# EAGLE design Addon-mapleCUx_HM-RFM69-RFM95-V15-003-TX-Fix (EAGLE 9.3.0)
MAPLE-CUx Large Version
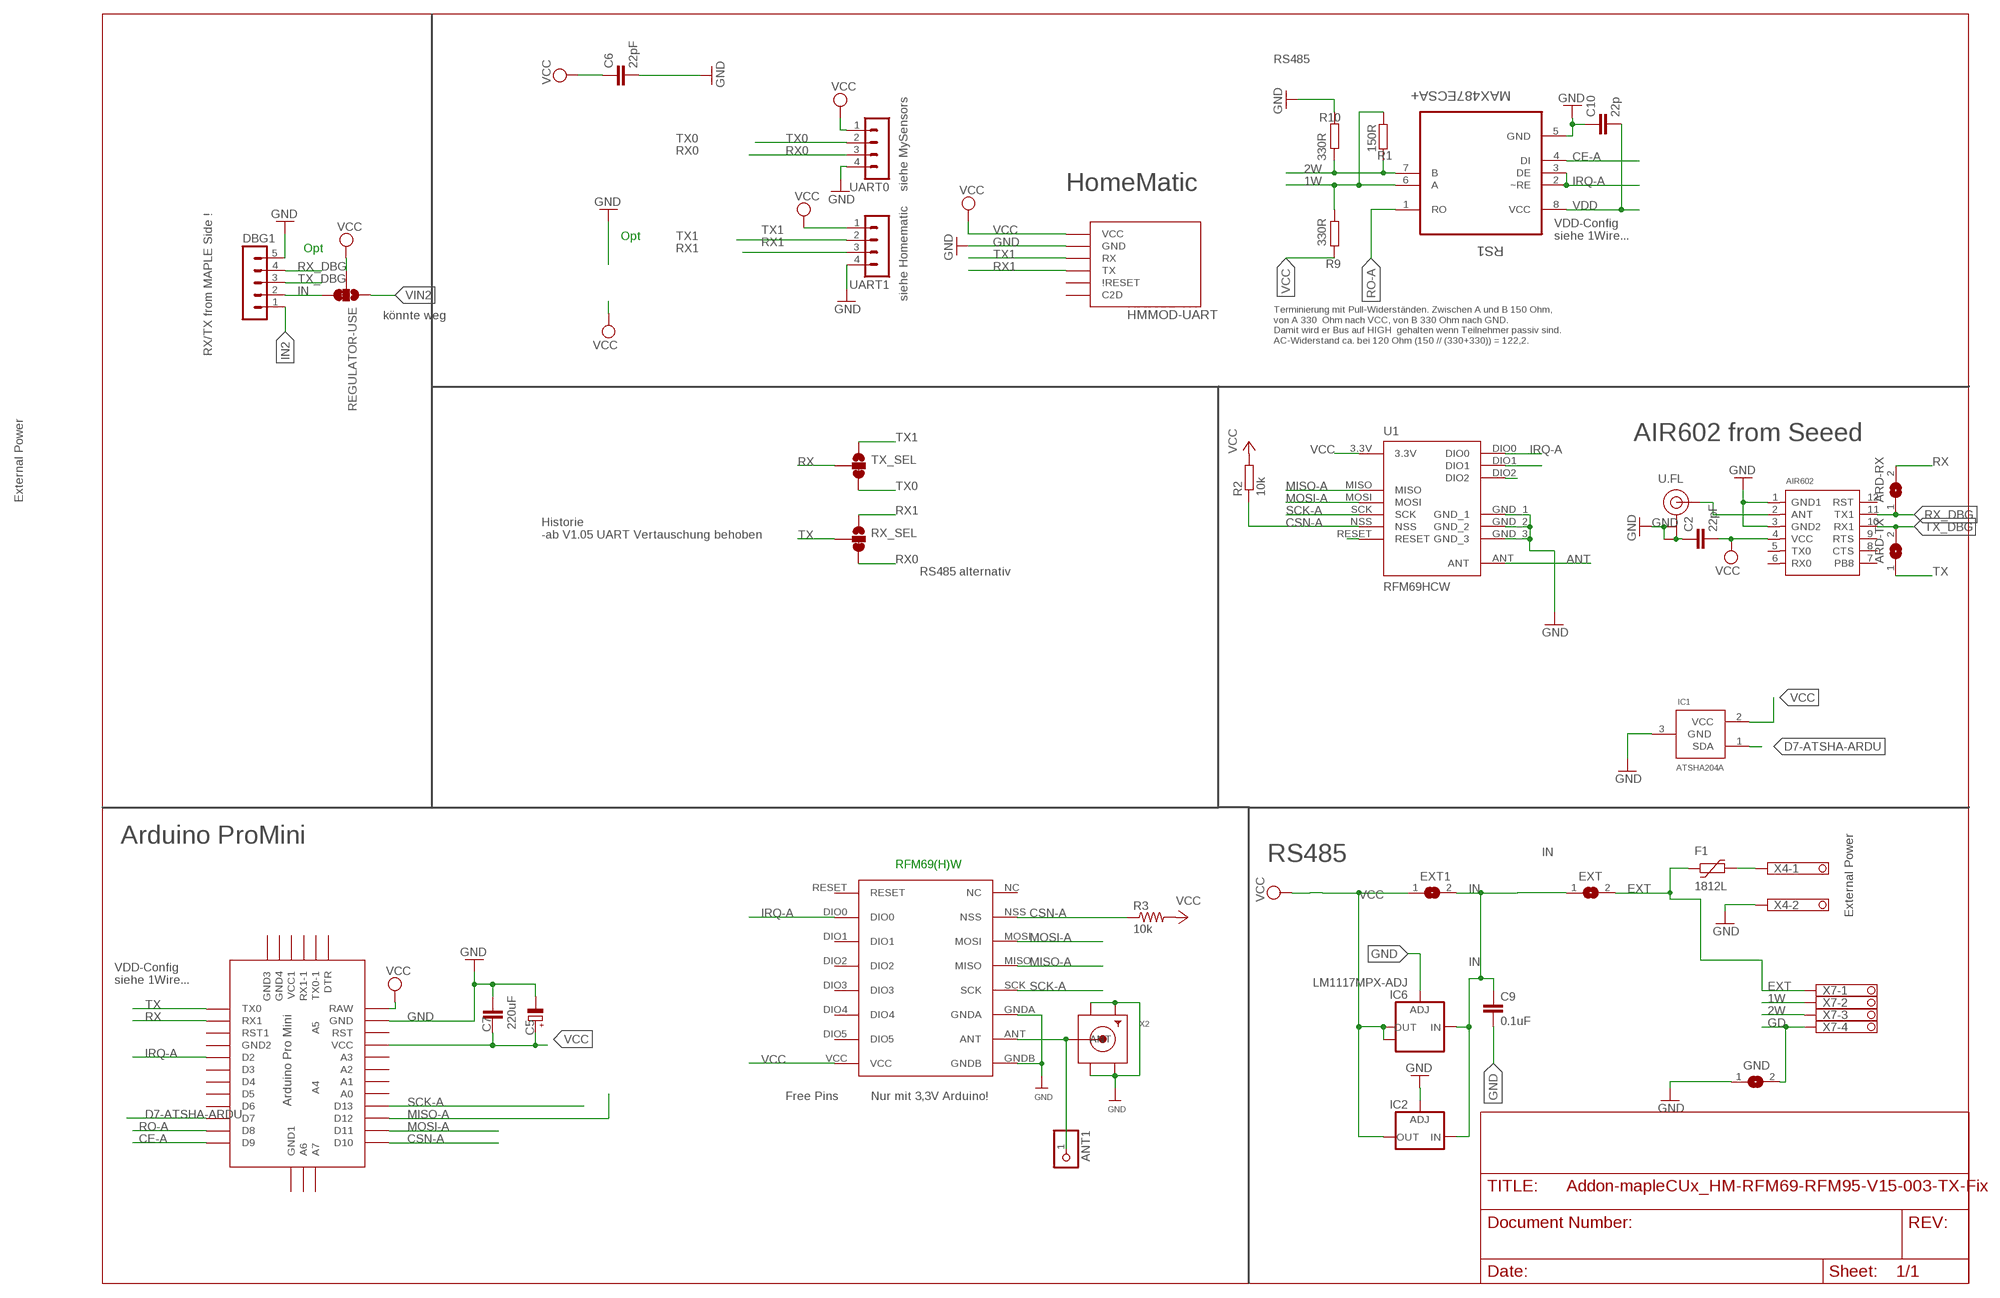
[diagram p0: schematic, sheet 1]

## Parts
AIR602  AIR602  [MODULE12P-2.0-10X12MM]
ANT1  PINHD-1X1  [1X01]
ARD-RX  SJ  [SJ]
ARD-TX  SJ  [SJ]
C2  22pF  C-EUC0805  [C0805]
C5  220uF  CPOL-EUE5-8.5  [E5-8,5]
C6  22pF  C-EUC0805  [C0805]
C7  C-EUC1812  [C1812]
C9  0.1uF  C-EUC1206  [C1206]
C10  22p  C-EUC0805  [C0805]
DBG1  MA05-1  [MA05-1]
EXT  SJ  [SJ]
EXT1  SJ  [SJ]
F1  1812L  [1812L]
GND  SJ  [SJ]
HMMOD-UART  HM-MOD-UARTDIL  [HM-MOD-UART-DIL]
IC1  ATSHA204A  [SOT23]
IC2  LD117ADT50TR  [DPACK]
IC6  LM1117MPX-ADJ  [SOT223]
R1  150R  R-EU_R0805  [R0805]
R2  10k  R-EU_M0805  [M0805]
R3  10k  RESISTOR0805-RES  [0805]
R9  330R  R-EU_R0805  [R0805]
R10  330R  R-EU_R0805  [R0805]
REGULATOR-USE  JUMPER-SMT_3_1-NC_TRACE_SILK  [SMT-JUMPER_3_1-NC_TRACE_SILK]
RFM69W  RFM69HW  [RFM]
RS1  MAX487ECSA+  [SOIC127P600X175-8N]
RX_SEL  JUMPER-SMT_3_1-NC_TRACE_SILK  [SMT-JUMPER_3_1-NC_TRACE_SILK]
TX_SEL  JUMPER-SMT_3_1-NC_TRACE_SILK  [SMT-JUMPER_3_1-NC_TRACE_SILK]
U1  RFM69HCW  [RFM69HCW-XXXS2]
U$2  ABK-PRO-MINI  [ABK-PRO-MINI]
U.FL  U.FL  [U.FL]
UART0  MA04-1  [MA04-1]
UART1  MA04-1  [MA04-1]
X2  SMACONNECTOR_EDGE  [SMA_EDGELAUNCH]
X4  1751248  [1751248]
X7  1751264  [1751264]

## Nets
1W: R1.1 R9.2 RS1.6(A) X7.2
2W: R1.2 R10.1 RS1.7(B) X7.3
AN: AIR602.2(ANT) U.FL.FEED(SIGNAL)
ANT: ANT1.1 RFM69W.ANT U1.ANT X2.P(ANT)
CE-A: RS1.4(DI) U$2.D9
CSN-A: R2.1 R3.1 RFM69W.NSS U1.NSS U$2.D10
D7-ATSHA-ARDU: IC1.1(SDA) U$2.D7
EXT [PWR]: EXT.2 F1.P$1 X7.1
GD [PWR]: GND.2 X7.4
GND [PWR]: AIR602.1(GND1) AIR602.3(GND2) C2.1 C5.- C6.2 C7.1 C9.2 C10.1 DBG1.5 GND.1 HMMOD-UART.2(GND) IC1.3(GND) IC2.1(ADJ) IC6.1(ADJ) R10.2 RFM69W.GNDA RFM69W.GNDB RS1.5(GND) U1.GND_1 U1.GND_2 U1.GND_3 U$2.GND U.FL.1(GND) U.FL.2(GND) UART0.4 UART1.4 X2.GND@1(GND4) X2.GND@2(GND3) X2.GND@3(GND2) X2.GND@4(GND1) X4.2
IN [PWR]: C9.1 DBG1.2 EXT1.2 EXT.1 IC2.3(IN) IC6.3(IN) REGULATOR-USE.3
IN2 [PWR]: DBG1.1
IRQ-A: RFM69W.DIO0 RS1.2(~RE) RS1.3(DE) U1.DIO0 U$2.D2
MISO-A: RFM69W.MISO U1.MISO U$2.D12
MOSI-A: RFM69W.MOSI U1.MOSI U$2.D11
N$2: U1.RESET
N$14: U1.DIO2
N$15: U1.DIO1
N$45 [PWR]: F1.P$2 X4.1
RO-A: RS1.1(RO) U$2.D8
RX: ARD-RX.2 TX_SEL.2 U$2.RX1
RX0: RX_SEL.3 UART0.3
RX1: HMMOD-UART.5(TX) RX_SEL.1 UART1.3
RX_DBG: AIR602.11(TX1) ARD-RX.1 DBG1.4
SCK-A: RFM69W.SCK U1.SCK U$2.D13
TX: ARD-TX.1 RX_SEL.2 U$2.TX0
TX0: TX_SEL.3 UART0.2
TX1: HMMOD-UART.6(RX) TX_SEL.1 UART1.2
TX_DBG: AIR602.10(RX1) ARD-TX.2 DBG1.3
VCC [PWR]: AIR602.4(VCC) C2.2 C5.+ C6.1 C7.2 EXT1.1 HMMOD-UART.1(VCC) IC1.2(VCC) IC2.4(OUT) IC6.2(OUT) IC6.TAB(OUT1) R2.2 R3.2 R9.1 REGULATOR-USE.2 RFM69W.VCC U1.3.3V U$2.RAW U$2.VCC UART0.1 UART1.1
VDD [PWR]: C10.2 RS1.8(VCC)
VIN2 [PWR]: REGULATOR-USE.1
Unconnected: AIR602.5(TX0) AIR602.6(RX0) AIR602.7(PB8) AIR602.8(CTS) AIR602.9(RTS) AIR602.12(RST) HMMOD-UART.3(C2D) HMMOD-UART.4(\!RESET) RFM69W.DIO1 RFM69W.DIO2 RFM69W.DIO3 RFM69W.DIO4 RFM69W.DIO5 RFM69W.NC RFM69W.RESET U$2.A0 U$2.A1 U$2.A2 U$2.A3 U$2.A4 U$2.A5 U$2.A6 U$2.A7 U$2.D3 U$2.D4 U$2.D5 U$2.D6 U$2.DTR U$2.GND1(GND2) U$2.GND2(GND3) U$2.GND3(GND4) U$2.GND4(GND1) U$2.RST U$2.RST1 U$2.RX1-1 U$2.TX0-1 U$2.VCC1

## Notes on the sheet
- RS485
- siehe MySensors | HomeMatic
- Opt
- VDD-Config
  siehe 1Wire...
- Opt
- siehe Homematic
- könnte weg
- Terminierung mit Pull-Widerständen. Zwischen A und B 150 Ohm,
  von A 330  Ohm nach VCC, von B 330 Ohm nach GND. 
  Damit wird er Bus auf HIGH  gehalten wenn Teilnehmer passiv sind.
  AC-Widerstand ca. bei 120 Ohm (150 // (330+330)) = 122,2.
- RX/TX from MAPLE Side !
- AIR602 from Seeed
- External Power
- Historie
  -ab V1.05 UART Vertauschung behoben
- RS485 alternativ
- Arduino ProMini
- RS485
- RFM69(H)W
- External Power
- VDD-Config
  siehe 1Wire...
- Free Pins | Nur mit 3,3V Arduino!

## Library data of the parts
AIR602 = AIR602:AIR602
ANT1 = pinhead:PINHD-1X1: PIN HEADER
ARD-RX ARD-TX EXT EXT1 GND = jumper:SJ: SMD solder JUMPER
C2 C6 C7 C9 C10 = rcl:C-EU: CAPACITOR, European symbol
C5 = rcl:CPOL-EU: POLARIZED CAPACITOR, European symbol
DBG1 = con-lstb:MA05-1: PIN HEADER; OC_FARNELL: unknown; OC_NEWARK: unknown
F1 = ptc-littlefuse:1812L
HMMOD-UART = wireless:HM-MOD-UART: eQ3 HM-MOD-UART-AW-SH2 wireless module for 868 MHz. DIL version for mounting with pin header (antenna upwards) and SMD variant available (antenna downwards).
IC1 = Sensor:ATSHA204A
IC2 = v-reg:LD117A?*: Low drop fixed and adjustable positive voltage regulators 1 A Source: http://www.st.com/stonline/products/literature/ds/7194/ld1117axx.pdf
IC6 = lm1117:LM1117MPX-ADJ
R1 R2 R9 R10 = rcl:R-EU_: RESISTOR, European symbol
R3 = doug:RESISTOR: Resistor Basic schematic elements and footprints for 0603, 1206, and PTH resistors.
REGULATOR-USE RX_SEL TX_SEL = SparkFun-Jumpers:JUMPER-SMT_3_1-NC_TRACE: Normally closed trace jumper (1 of 2 connections) This jumper has a trace between two pads so it's normally closed (NC). The other connection is normally open (NO). Use a razor knife to open the connection. For best results follow the IPC guidelines for cutting traces: Cutout at least 0.063 mm (0.005 in). Remove all loose material to clean up the cut area. Seal the cut with an approved epoxy. Reapply solder to reclose the connection, or to close the NO connection.
RFM69W = hoperf:RFM69HW
RS1 = Maxim_By_element14_Batch_1:MAX487ECSA+: Low-Power, Slew-Rate-Limited RS-485/RS-422 Transceivers; MPN: MAX487ECSA+; OC_FARNELL: 9724532; OC_NEWARK: 68K4803; PACKAGE: SOIC-8; SUPPLIER: Maxim
U1 = doug:RFM69H
U$2 = Arduino-clone:ABK-PRO-MINI: ABK Pro-Mini Arduino Clone
U.FL = SparkFun-Connectors:U.FL: SMD Antenna Connector - U.FL 2mm height, 3.0mm x 3.0mm receptacle size. SparkFun Products: SparkFun WiFi Shield - ESP8266 <https://www.sparkfun.com/products/13287> SparkFun ESP8266 Thing <https://www.sparkfun.com/products/13231> SparkFun MiniGen - Pro Mini Signal Generator Shield <https://www.sparkfun.com/products/11420>; PROD_ID: CONN-09193; SF_ID: WRL-09144
UART0 UART1 = con-lstb:MA04-1: PIN HEADER; OC_FARNELL: unknown; OC_NEWARK: unknown
X2 = adafruit:SMACONNECTOR: SMA Connector 90° DIP SMA Connector, 50 Ohm (4UConnector: 07259)
X4 = con-phoenix-350:1751248: MKDS 1/ 2-3,5 Printklemme Nennstrom: 10 A Bemessungsspannung: 160 V Raster: 3,5 mm Polzahl: 2 Montageart: Löten Anschlussart: Schraubanschluss Anschlussrichtung vom Leiter zur Platine: 0° Source: http://eshop.phoenixcontact.com .. 1751248.pdf; OC_FARNELL: unknown; OC_NEWARK: unknown
X7 = con-phoenix-350:1751264: MKDS 1/ 4-3,5 Printklemme Nennstrom: 10 A Bemessungsspannung: 160 V Raster: 3,5 mm Polzahl: 4 Montageart: Löten Anschlussart: Schraubanschluss Anschlussrichtung vom Leiter zur Platine: 0° Source: http://eshop.phoenixcontact.com .. 1751264.pdf; MPN: 1751264; OC_FARNELL: unknown; OC_NEWARK: 10R0934

## Net classes
0 default: width 0.305 mm
1 PWR: width 0.457 mm

## Board
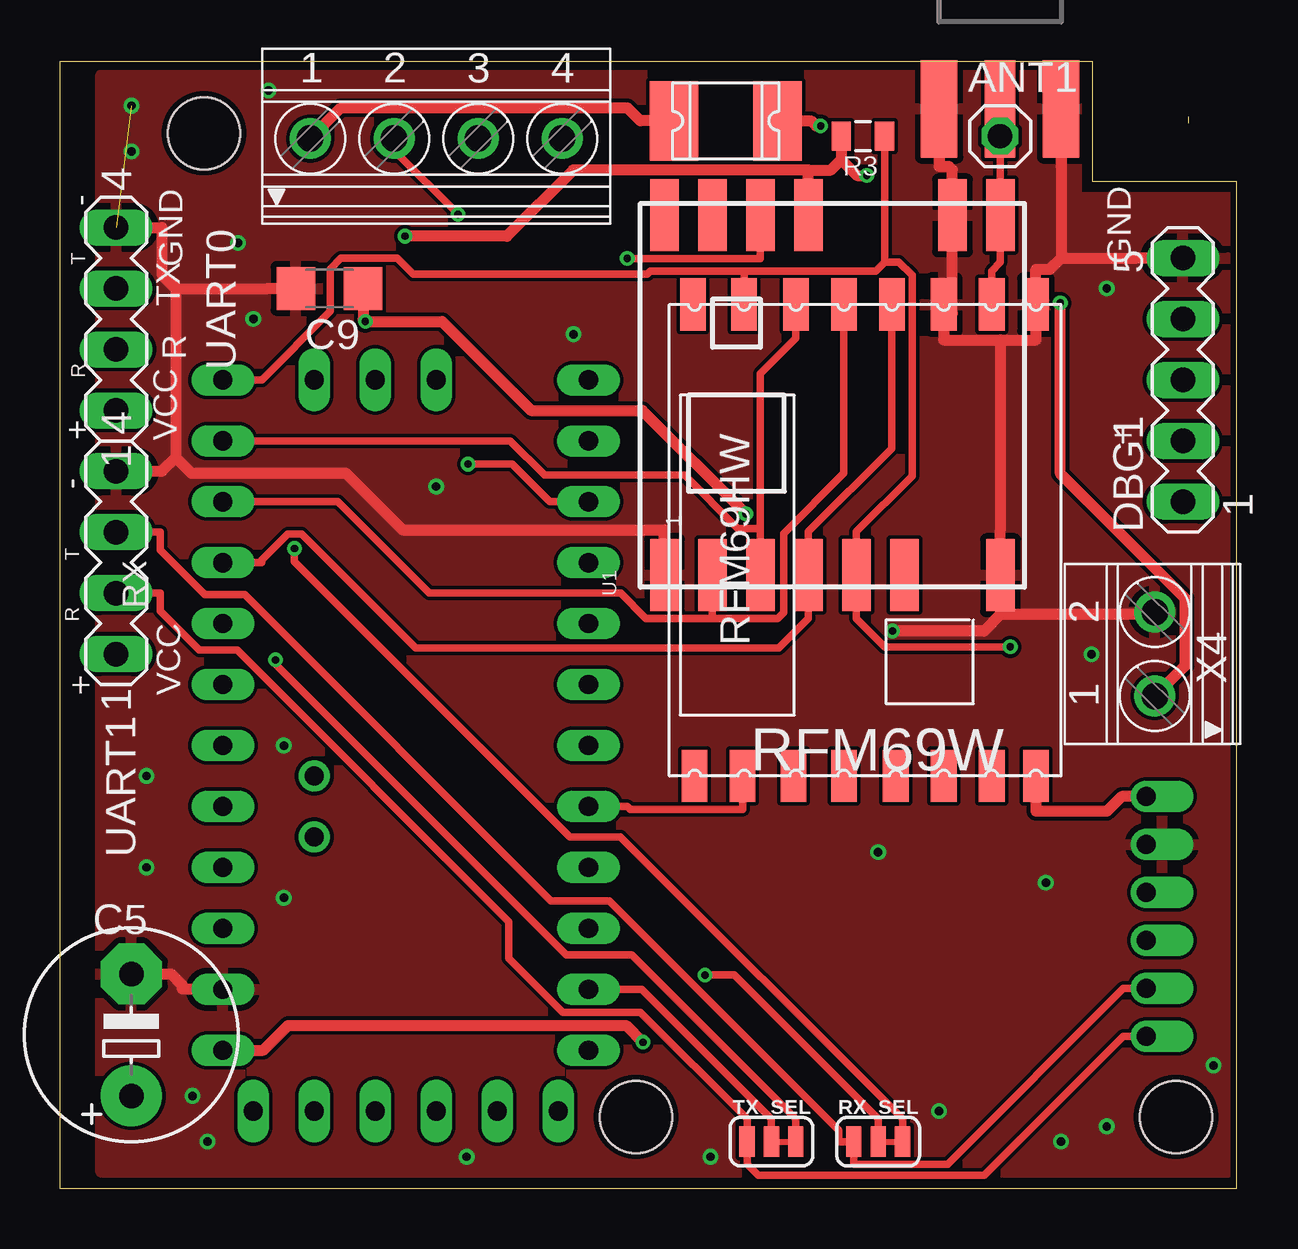
[diagram p1: board, top side]
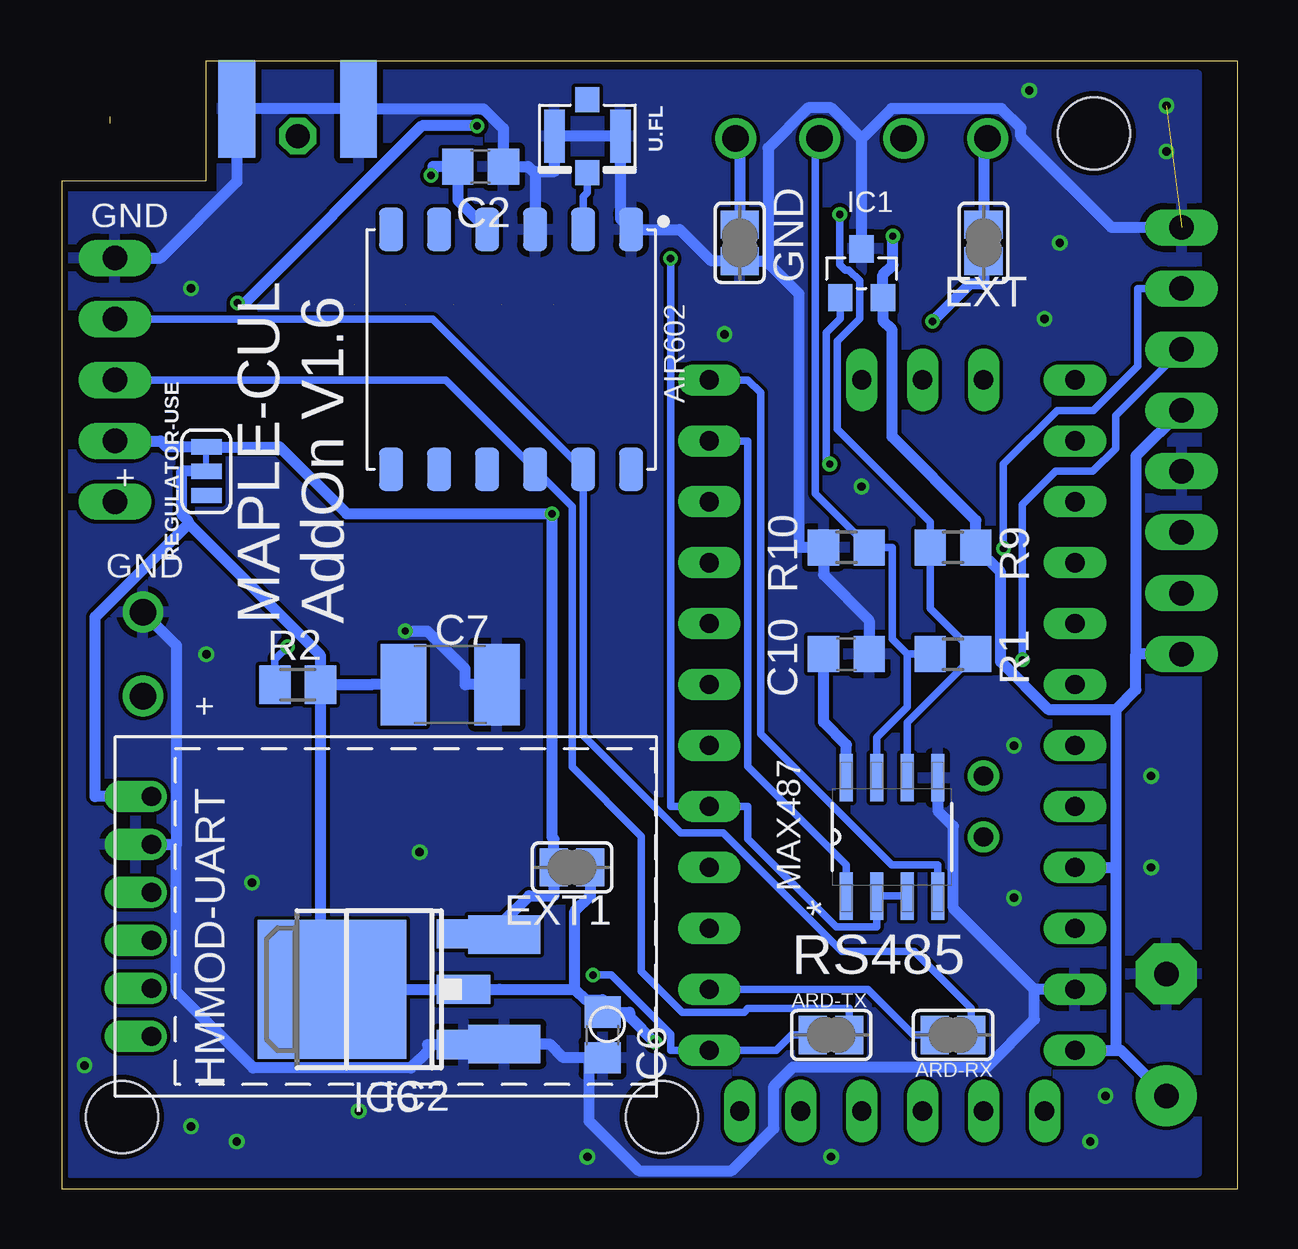
[diagram p2: board, bottom side, seen from below]

Size 49 x 47 mm. Coordinates in mm from the lower left corner, seen from the top.
Outline: 47,44.7 47,44.41
Outline: 0,0 0,47 43,47 43,42 49,42 49,0 0,0
Copper layers (1*16): Top 0.035mm / dielectric 1.5mm / Bottom 0.035mm
Design rules "SeeedStudio_2layer_DRU_no_angle_20140221": minimum track width 6mil, minimum drill 12mil, track to track 6mil, track to pad 6mil, pad to pad 6mil, via to via 6mil, smd to smd 0mil, copper to edge 10mil, drill to drill 10mil, minimum pad ring 10mil, minimum via ring 6mil, stop-mask expansion 2mil, vias tented up to drill 100mil, thermal gap 10mil
Holes 3 mm at 6,44 24,3 46.5,3
tRestrict: area 0.4,2 to 1.1,47.1
bRestrict: area 0.4,0.7 to 1.1,46.4

### Footprints (pad centres in the part's own frame; a part is rotated, then mirrored left to right if it is on the bottom)
MODULE12P-2.0-10X12MM = smd 1.8 x 1: 1 -5,5; 2 -5,3; 3 -5,1; 4 -5,-1; 5 -5,-3; 6 -5,-5; 7 5,-5; 8 5,-3; 9 5,-1; 10 5,1; 11 5,3; 12 5,5
1X01 = drill 1.016 octagon: 1 0,0
SJ = smd 1.168 x 1.6: 1 -0.762,0; 2 0.762,0
C0805 = smd 1.3 x 1.5: 1 -0.95,0; 2 0.95,0
E5-8,5 = drill 1.016 pad 2.54: + -2.54,0 | drill 1.016 pad 2.54 octagon: - 2.54,0
C1812 = smd 1.9 x 3.4: 1 -1.95,0; 2 1.95,0
C1206 = smd 1.6 x 1.8: 1 -1.4,0; 2 1.4,0
MA05-1 = drill 1.016 long: 1 -5.08,0; 2 -2.54,0; 3 0,0; 4 2.54,0; 5 5.08,0
1812L = smd 2.03 x 3.3: P$1 -2.16,0; P$2 2.16,0
HM-MOD-UART-DIL = drill 0.8 offset: 1 0,12; 2 0,10; 3 0,8; 4 0,6; 5 0,4; 6 0,2
SOT23 = smd 1.016 x 1.143: 1 -0.889,-1.016; 2 0.889,-1.016; 3 0,1.016
DPACK = smd 1.6 x 3: 1 -2.28,-4.8; 3 2.28,-4.8 | smd 5.8 x 6.2: 4 0,2.38
SOT223 = smd 1.219 x 2.235: 1 -2.311,-3.099; 2 0,-3.099; 3 2.311,-3.099 | smd 3.6 x 2.2: TAB 0,3.099
R0805 = smd 1.3 x 1.5: 1 -0.95,0; 2 0.95,0
M0805 = smd 1.3 x 1.6: 1 -0.95,0; 2 0.95,0
0805 = smd 0.8 x 1.2: 1 -0.9,0; 2 0.9,0
SMT-JUMPER_3_1-NC_TRACE_SILK = smd 0.635 x 1.27: 1 -1.016,0; 2 0,0; 3 1.016,0
RFM = smd 2.184 x 1.067: ANT 19.651,2.889; DIO0 0,13.27; DIO1 0,11.143; DIO2 0,9.047; DIO3 0,6.889; DIO4 0,4.889; DIO5 0,2.889; GNDA 19.651,4.889; GNDB 19.651,1.048; MISO 19.651,9.047; MOSI 19.651,11.047; NC 19.651,15.334; NSS 19.651,13.206; RESET 0,15.27; SCK 19.651,7.048; VCC 0,1.048
SOIC127P600X175-8N = smd 1.981 x 0.533: 1 -2.464,1.905; 2 -2.464,0.635; 3 -2.464,-0.635; 4 -2.464,-1.905; 5 2.464,-1.905; 6 2.464,-0.635; 7 2.464,0.635; 8 2.464,1.905
RFM69HCW-XXXS2 = smd 3 x 1.2: 3.3V 7.5,1; ANT 7.5,-7; DIO0 7.5,3; DIO1 7.5,5; DIO2 7.5,7; GND_1 7.5,-5; GND_2 -7.5,-7; GND_3 -7.5,7; MISO -7.5,5; MOSI -7.5,3; NSS -7.5,-1; RESET -7.5,-3; SCK -7.5,1
ABK-PRO-MINI = drill 0.8 long: A0 10.16,-3.81; A1 10.16,-6.35; A2 10.16,-8.89; A3 10.16,-11.43; A6 3.81,-21.59; A7 6.35,-21.59; D2 -5.08,-3.81; D3 -5.08,-6.35; D4 -5.08,-8.89; D5 -5.08,-11.43; D6 -5.08,-13.97; D7 -5.08,-16.51; D8 -5.08,-19.05; D9 -5.08,-21.59; D10 10.16,-21.59; D11 10.16,-19.05; D12 10.16,-16.51; D13 10.16,-13.97; DTR 8.89,8.89; GND 10.16,3.81; GND1 -5.08,-1.27; GND2 -3.81,8.89; GND3 -1.27,8.89; GND4 1.27,-21.59; RAW 10.16,6.35; RST 10.16,1.27; RST1 -5.08,1.27; RX1 -5.08,3.81; RX1-1 3.81,8.89; TX0 -5.08,6.35; TX0-1 6.35,8.89; VCC 10.16,-1.27; VCC1 1.27,8.89 | drill 0.8: A4 6.35,-5.08; A5 6.35,-2.54
U.FL = smd 2.2 x 0.85: 1 0,1.375; 2 0,-1.375 | smd 1.05 x 1: FEED 1.525,0; NC -1.525,0
MA04-1 = drill 1.016 long: 1 -3.81,0; 2 -1.27,0; 3 1.27,0; 4 3.81,0
SMA_EDGELAUNCH = smd 4.064 x 1.524: GND@1 2.032,-2.54; GND@2 2.032,2.54 | smd 4.064 x 1.524 bottom: GND@3 2.032,2.54; GND@4 2.032,-2.54 | smd 4.064 x 1.27: P 2.032,0
1751248 = drill 1.1 pad 1.7: 1 -1.75,-0.1; 2 1.75,-0.1
1751264 = drill 1.1 pad 1.7: 1 -5.25,-0.1; 2 -1.75,-0.1; 3 1.75,-0.1; 4 5.25,-0.1

### Placement (x,y rotation side)
AIR602  30.28,34.99 270 bottom
ANT1  39.17,43.88 0 top
ARD-RX  11.87,6.41 180 bottom
ARD-TX  16.94,6.41 0 bottom
C2  31.55,42.61 180 bottom
C5  2.98,6.41 90 top
C6  26.47,6.41 270 bottom
C7  32.82,21.02 180 bottom
C9  11.23,37.53 180 top
C10  16.31,22.29 180 bottom
DBG1  46.79,33.72 90 top
EXT  10.59,39.44 90 bottom
EXT1  27.74,13.4 180 bottom
F1  27.74,44.52 0 top
GND  20.75,39.44 90 bottom
HMMOD-UART  45.27,4.35 0 bottom
IC1  15.67,38.16 0 bottom
IC2  35.36,8.32 90 bottom
IC6  35.36,8.32 90 bottom
R1  11.87,22.29 180 bottom
R2  39.17,21.02 0 bottom
R3  33.45,43.88 180 top
R9  11.87,26.73 180 bottom
R10  16.31,26.73 180 bottom
REGULATOR-USE  42.98,29.91 90 bottom
RFM69W  41.71,17.21 90 top
RS1  14.41,14.67 90 bottom
RX_SEL  34.09,1.97 0 top
TX_SEL  29.64,1.97 0 top
U1  32.19,33.09 90 top
U$2  16.94,12.13 180 top
U.FL  27.11,43.88 270 bottom
UART0  2.34,36.26 90 top
UART1  2.34,26.1 90 top
X2  39.17,47.05 270 top
X4  45.52,22.29 90 top
X7  15.67,43.88 0 top

### Tracks (layer width: path | path; a pad name or v marks a point on that pad's centre or on a via)
1W  (via drill 0.3 pad 0.61)
  Top 0.305: X7.2 13.92,43.28 v16.58,40.62
  Bottom 0.305: RS1.6 13.77,19.43 R1.1 12.81,24.19 R9.2 12.81,27.79 16.69,31.66 16.69,35.34 15.75,36.27 15.75,37.85 16.21,38.3 16.36,38.3 16.58,38.53 v16.58,40.62
2W
  Bottom 0.305: X7.3 17.61,43.59 17.61,28.99 R10.1 14.41,26.73 14.41,22.92 13.77,22.29 | RS1.7 15.04,18.81 13.77,20.08 13.77,22.29 | R1.2 13.77,22.29
AN
  Bottom 0.305: U.FL.FEED 27.11,41.52 27.28,41.35 AIR602.2
ANT  (1 unrouted)
  Top 0.305: RFM69W.ANT 38.82,38.26 39.19,38.62 U1.ANT 39.19,42.39 39.17,42.41 ANT1.1 X2.P
CE-A
  Bottom 0.305: RS1.4 12.5,13.5 14.41,13.5 19.87,18.96 19.87,33.18 20.41,33.72 U$2.D9
CSN-A  (via drill 0.3 pad 0.61)  (1 unrouted)
  Top 0.305: U$2.D10 8.4,33.72 11.26,36.58 11.26,38.34 11.71,38.79 14.05,38.79 14.71,38.12 24.46,38.12 24.6,38.26 28.5,38.26 | RFM69W.NSS 28.5,38.26 | 34.36,38.63 33.98,38.26 28.5,38.26 | 34.36,38.63 34.95,38.63 35.5,38.08 35.5,29.71 33.19,27.39 U1.NSS 33.19,24.8 33.19,23.78 34.37,22.59 v39.59,22.59 | 34.36,38.63 34.36,42.98 R3.1
  Bottom 0.305: R2.1 40.12,22.12 40.06,22.12 v39.59,22.59
D7-ATSHA-ARDU  (via drill 0.3 pad 0.61)
  Top 0.305: v17,30.21 18.84,30.21 20.41,28.64 U$2.D7
  Bottom 0.305: v17,30.21 17.14,30.35 17.14,35.69 16.56,36.27 IC1.1
EXT
  Top 0.457: F1.P$1 24.18,44.52 23.64,45.06 11.71,45.06 X7.1
  Bottom 0.457: X7.1 10.59,43.61 EXT.2
GD
  Bottom 0.457: X7.4 20.75,43.61 GND.2
GND  (via drill 0.3 pad 0.61, 0.35)  (3 unrouted)
  Top 0.457: X2.GND@1 36.63,42.61 37.04,42.61 37.19,42.47 U1.GND_1 37.19,36.49 36.82,36.12 | 4.82,30.49 4.24,29.91 UART1.4 | 4.82,37.53 4.82,30.49 | 4.82,30.49 5.48,29.83 11.91,29.83 14.28,27.47 25.19,27.47 U1.GND_3 | 4.82,37.53 4.24,38.11 4.24,40.07 UART0.4 | 4.82,37.53 8.65,37.53 C9.2 | 39.19,23.93 38.5,23.25 v34.69,23.25 | 39.19,35.39 39.19,27.47 U1.GND_2 39.19,23.93 | 39.19,35.39 36.82,35.39 36.82,36.12 | 39.19,35.39 40.66,35.39 RFM69W.GNDB 40.66,38.34 41.25,38.34 41.71,38.8 | X4.2 45.51,23.93 39.19,23.93 | 41.71,38.8 44.89,38.8 DBG1.5 | 41.71,38.8 41.71,42.61 X2.GND@2 | RFM69W.GNDA 36.82,36.12 | U$2.GND 5.1,8.32 5.1,8.48 4.63,8.95 C5.-
  Bottom 0.457: 29.28,42.4 28.48,42.4 U.FL.2 U.FL.1 25.73,40.44 AIR602.1 23.25,39.99 21.94,38.67 GND.1 19.73,38.67 19.65,38.67 | 29.28,42.4 29.36,42.4 29.57,42.61 C2.1 30.6,44.19 31.43,45.02 X2.GND@1 | 29.28,42.4 AIR602.3 | 15.67,43.78 16.95,45.06 17.9,45.06 19.57,43.39 19.57,38.75 19.65,38.67 | 15.67,43.78 15.67,40.13 IC1.3 | UART0.4 5.25,40.07 9.04,43.86 9.04,44.22 9.85,45.03 14.43,45.03 15.67,43.78 | 44.23,14.35 44.23,8.24 41.03,5.04 34.46,5.04 33.76,5.74 33.76,6.01 IC6.1 30.59,6.01 IC2.1 28.68,6.04 28.1,5.46 27.04,5.46 | HMMOD-UART.2 44.23,14.35 | X4.2 44.23,22.65 44.23,14.35 | v34.69,23.25 33.77,23.25 32.2,21.69 32.2,21.02 C7.1 | X2.GND@1 | X2.GND@1 X2.GND@2 | X2.GND@2 | 19.65,38.67 18.29,37.31 18.29,26.73 R10.2 17.26,25.6 15.36,23.7 C10.1 | 8.47,8.32 11.85,11.7 11.85,15.11 12.5,15.76 RS1.5 | 27.04,5.46 27.04,2.83 24.96,0.76 21.09,0.76 19.33,2.52 19.33,4.28 18.53,5.08 10.45,5.08 8.47,7.06 8.47,8.32 | U$2.GND 8.47,8.32 | C6.2 27.04,5.46 | DBG1.5 44.89,38.8 41.71,41.98 X2.GND@2
  other vias: 2.98,45.15 2.98,43.24 8.69,45.78 7.42,39.44 8.05,36.26 15.67,29.27 3.61,17.21 3.61,13.4 21.39,35.62 43.61,37.53 42.98,22.29 41.08,12.77 34.09,14.04 48.06,5.14 43.61,2.61 41.71,1.97 36.63,3.24 27.11,1.34 16.94,1.34 6.15,1.97 5.52,3.88 9.33,12.13 9.33,18.48
  pour Bottom: 1.7,0.7 1.7,46.42 42.34,46.42 42.34,41.34 48.69,41.34 48.69,0.7
  pour Top: 1.7,46.42 42.34,46.42 42.34,41.34 48.69,41.34 48.69,0.7 1.7,0.7
IN  (via drill 0.3 pad 0.61)
  Top 0.457: v28.57,28.14 24.26,32.45 19.63,32.45 15.92,36.16 v12.72,36.16 12.63,36.25 C9.1
  Bottom 0.457: 30.56,11.19 29.53,12.22 28.5,12.22 EXT1.2 28.5,14.58 28.57,14.65 v28.57,28.14 37.13,28.14 39.92,30.93 REGULATOR-USE.3 44.63,30.93 44.89,31.18 DBG1.2 | 30.56,11.19 30.76,10.99 30.76,10.63 IC6.3 | v12.72,36.16 11.17,37.71 10.59,37.71 EXT.1 | IC2.3 30.56,11.19
IRQ-A  (via drill 0.3 pad 0.61)
  Top 0.305: RFM69W.DIO0 28.44,15.81 23.77,15.81 23.64,15.94 U$2.D2 | v23.64,38.78 29.19,38.78 U1.DIO0
  Bottom 0.305: v23.64,38.78 23.64,15.94 U$2.D2 20.41,15.94 20.41,14.58 16.74,10.91 15.04,10.91 RS1.2 RS1.3
MISO-A  (1 unrouted)
  Top 0.305: 27.19,23.78 29.91,23.78 30.16,24.03 30.16,27.32 32.66,29.83 RFM69W.MISO | 27.19,23.78 27.19,23.9 U1.MISO | U$2.D12 8.4,28.64 11.57,28.64 15.38,24.83 23.36,24.83 24.41,23.78 27.19,23.78
MOSI-A  (1 unrouted)
  Top 0.305: 29.19,27.53 29.19,33.99 30.66,35.46 RFM69W.MOSI | 29.19,27.53 29.19,27.39 U1.MOSI | 29.19,27.53 28.25,27.53 26.03,29.75 20.2,29.75 18.77,31.18 8.4,31.18 U$2.D11
N$45  (via drill 0.3 pad 0.61)
  Top 0.457: X4.1 46.89,21.81 46.89,24.6 41.68,29.81 v41.68,36.93 | F1.P$2 31.3,44.52 31.5,44.31 v31.69,44.31
  Bottom 0.457: v31.69,44.31 34,44.31 41.38,36.93 v41.68,36.93
RO-A
  Bottom 0.305: U$2.D8 20.41,31.18 20.41,17.6 16.31,13.5 RS1.1
RX
  Top 0.305: U$2.RX1 24.23,8.32 29.64,2.91 TX_SEL.2
  Bottom 0.305: U$2.RX1 15.42,8.32 13.52,6.41 ARD-RX.2
RX0  (via drill 0.3 pad 0.61)
  Top 0.305: RX_SEL.3 35.11,2.91 23.34,14.68 21.24,14.68 9.77,26.15 v9.77,26.69
  Bottom 0.305: UART0.3 4.17,37.53 4.17,34.3 6.02,32.45 7.53,32.45 9.77,30.21 v9.77,26.69
RX1
  Top 0.305: UART1.3 4.17,27.37 4.17,26.63 6.03,24.77 7.69,24.77 20.45,12.01 22.89,12.01 32.45,2.45 32.45,1.97 RX_SEL.1 33.07,1.03 36.99,1.03 44.31,8.35 HMMOD-UART.5
RX_DBG
  Bottom 0.305: ARD-RX.1 11.1,7.52 13.47,9.89 16.51,9.89 21.45,14.83 23.22,14.83 27.28,18.89 AIR602.11 33.55,36.26 DBG1.4
SCK-A  (1 unrouted)
  Top 0.305: RFM69W.SCK 34.66,30.87 31.19,27.39 U1.SCK 31.19,24.68 31.19,23.78 29.95,22.55 14.83,22.55 10.07,27.3 9.49,27.3 8.4,26.21 8.4,26.1 U$2.D13
TX  (via drill 0.3 pad 0.61)
  Top 0.305: v26.87,8.91 28.08,8.91 34.09,2.91 RX_SEL.2
  Bottom 0.305: v26.87,8.91 26.11,8.91 23.64,6.45 23.64,5.78 U$2.TX0 19.23,5.78 18.6,6.41 ARD-TX.1
TX0  (via drill 0.3 pad 0.61)
  Top 0.305: v8.98,22.05 8.98,21.87 21.1,9.75 23.82,9.75 30.66,2.91 TX_SEL.3
  Bottom 0.305: UART0.2 5.09,32.24 5.09,30.86 6.04,29.91 7.59,29.91 8.98,28.52 v8.98,22.05
TX1
  Top 0.305: HMMOD-UART.6 44.31,6.35 38.52,0.56 29.1,0.56 28.63,1.03 TX_SEL.1 28.63,2.91 24.18,7.36 20.95,7.36 18.7,9.6 18.7,11.14 7.39,22.45 5.81,22.45 4.17,24.09 4.17,24.83 UART1.2
TX_DBG
  Bottom 0.305: DBG1.3 33.01,33.72 AIR602.10 27.74,28.45 27.74,17.59 24.85,14.7 24.85,9.06 23.14,7.36 20.57,7.36 20.41,7.52 16.18,7.52 ARD-TX.2
VCC  (via drill 0.3 pad 0.61)
  Top 0.457: v24.29,6.11 23.58,6.82 9.51,6.82 8.47,5.78 U$2.RAW | HMMOD-UART.1 44.23,16.35 43.62,15.74 40.66,15.74 RFM69W.VCC | 32.56,42.9 33.21,42.24 v33.61,42.24 | 31.19,42.47 | 31.19,42.47 32.12,42.47 32.56,42.9 | 31.19,42.47 21.38,42.47 18.62,39.71 v14.37,39.71 | v14.37,39.71 | R3.2 32.56,42.9 | U1.3.3V 31.19,42.47
  Bottom 0.457: R2.2 36.1,21.02 C7.2 | R2.2 38.22,22.23 43.72,27.73 | 5.1,19.96 7.87,19.96 9.88,21.98 9.88,25.7 R9.1 10.91,27.87 14.41,31.36 14.41,35.81 14.79,36.2 IC1.2 14.79,38.1 14.37,38.51 v14.37,39.71 | 5.1,5.78 4.88,5.78 C5.+ | 5.1,5.78 5.94,5.78 U$2.RAW | 5.1,13.4 5.1,5.78 | 5.1,19.96 5.1,13.4 | 5.1,19.96 4.24,20.81 4.24,22.29 | U$2.VCC 5.1,13.4 | UART0.1 4.24,30.55 4.24,22.29 | v24.29,6.11 25.34,7.16 25.34,7.36 C6.1 26.47,7.88 27.18,7.88 27.62,8.32 | 27.62,8.32 30.76,8.32 IC6.2 IC2.4 IC6.TAB 38.46,10.5 38.22,10.74 R2.2 | 27.62,8.32 27.62,11.58 26.98,12.22 EXT1.1 | UART1.1 4.24,22.29 | v33.61,42.24 33.53,42.32 33.53,42.61 C2.2 32.5,41.21 AIR602.4 | 43.72,27.73 | 43.72,27.73 43.72,27.81 44,28.09 44,29.91 REGULATOR-USE.2 | 43.72,27.73 47.61,23.84 47.61,16.35 HMMOD-UART.1
VDD
  Bottom 0.457: RS1.8 16.31,18.51 17.26,19.46 C10.2

### Text on the board
tNames: GND | - | T | GND | TX | R | R | + | VCC | + | - | T | R | RX | VCC | +
bNames: GND | + | GND | MAPLE-CUL / AddOn V1.6 | + | MAX487 | RS485